# Altium schematic sheet DAUGHTER.SchDoc
size A; SheetNumber: 1; SheetTotal: 1
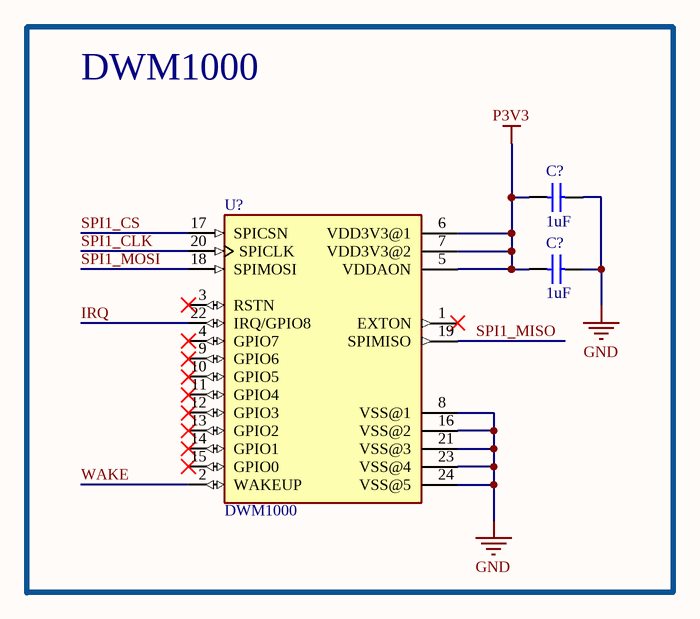
[diagram p0: DAUGHTER.SchDoc]

## Parts
(Parts that share a designator on the sheet are numbered #1, #2 ... from top to bottom, then left to right.)
C?#1  1uF  [CAP_0603]
C?#2  1uF  [CAP_0603]
U?  DWM1000  [XCVR_DWM1000]

## Blocks framed on the sheet
DWM1000: C?#1 C?#2 U?

## Nets
GND: C?#1.2 C?#2.2 U?.8(VSS@1) U?.16(VSS@2) U?.21(VSS@3) U?.23(VSS@4) U?.24(VSS@5)
P3V3: C?#1.1 C?#2.1 U?.5(VDDAON) U?.6(VDD3V3@1) U?.7(VDD3V3@2)
IRQ: U?.22(IRQ/GPIO8)
SPI1_CLK: U?.20(SPICLK)
SPI1_CS: U?.17(SPICSN)
SPI1_MISO: U?.19(SPIMISO)
SPI1_MOSI: U?.18(SPIMOSI)
WAKE: U?.2(WAKEUP)

Not connected (* = marked no-connect by the designer): U? 1(EXTON)* 3(RSTN)* 4(GPIO7)* 9(GPIO6)* 10(GPIO5)* 11(GPIO4)* 12(GPIO3)* 13(GPIO2)* 14(GPIO1)* 15(GPIO0)*

## Library data of the parts
C?#1 C?#2 = CMP-001-00097-1: Cap Ceramic 1uF 25V X7R 10% Pad SMD 0603 125C Automotive T/R; Voltage Rating: 25V; Case/Package: 0603; Capacitance: 1uF; Dielectric: X7R; Tolerance: 10%
U? = CMP-236-000000-2: 802.15.4 IR-UWB Transceiver Module 3.5GHz ~ 6.5GHz Integrated, Chip Surface Mount; MF: Decawave Limited; Package: Module Decawave; Source: SnapEDAsch.SchLib; Availability: Unavailable; Component Type: Standard; Price: None; Value: *; SnapEDA_Link: https://www.snapeda.com/parts/DWM1000/Decawave%20Limited/view-part/327593/?ref=snap; MP: DWM1000; Pin Count: 24; Design Item ID: DWM1000